# Altium schematic sheet Headers_Controller.SchDoc
size A3; SheetNumber: 1; SheetTotal: 1
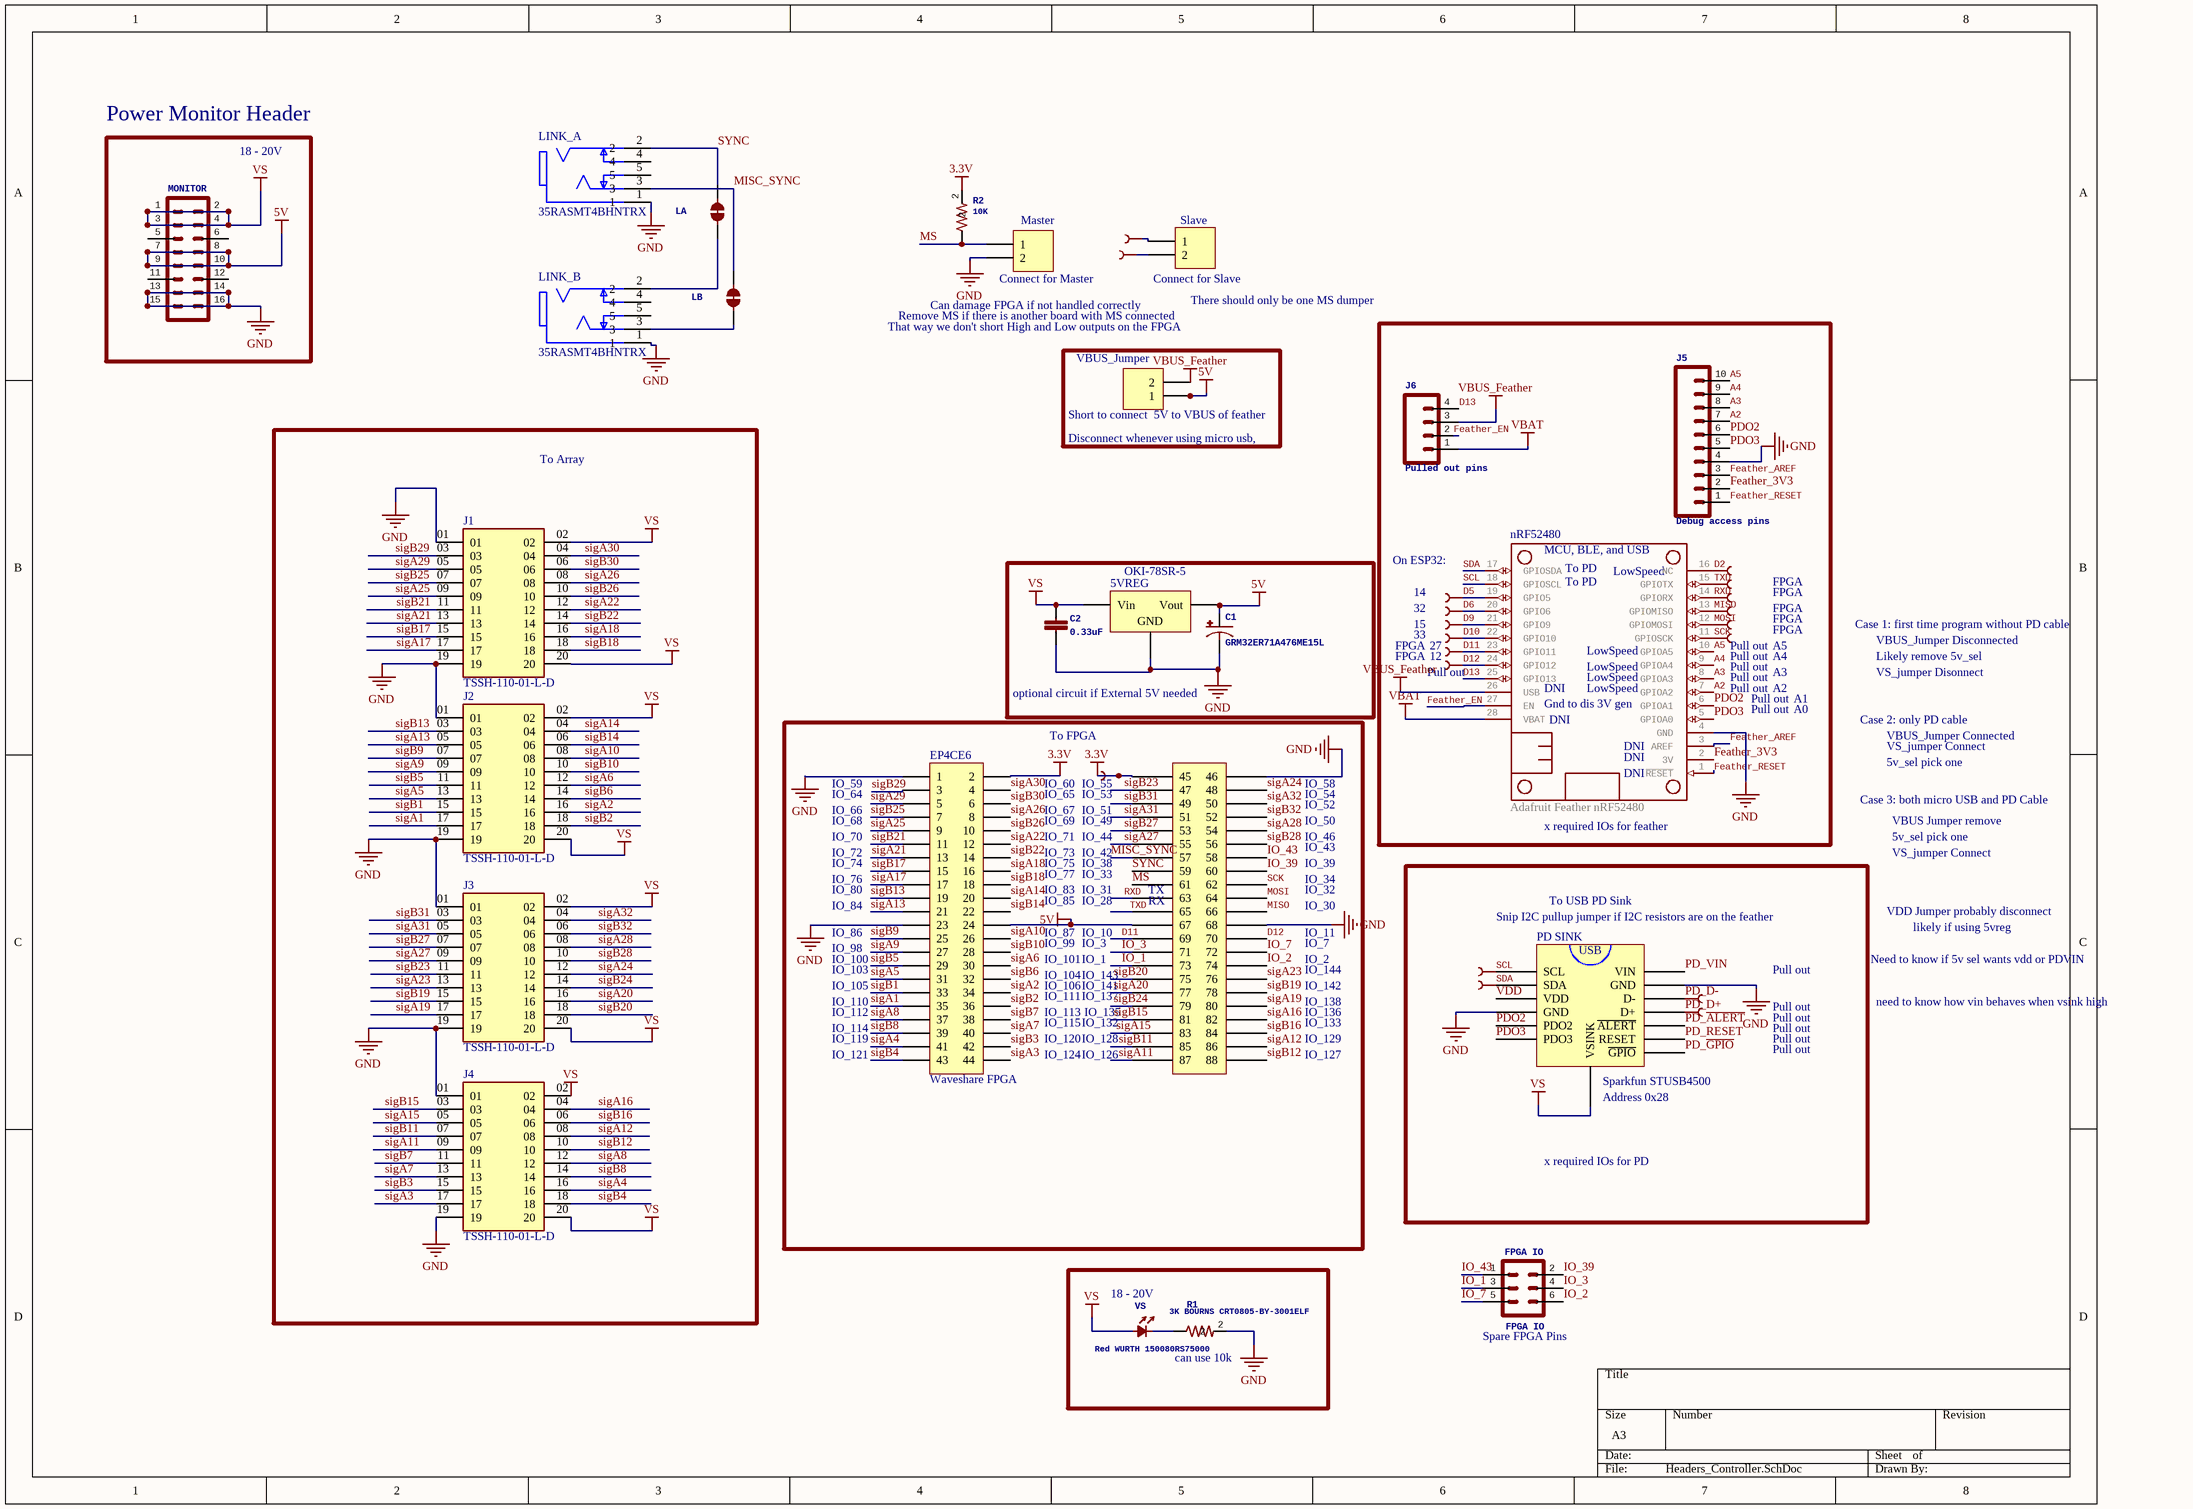
[diagram p0: Headers_Controller.SchDoc]

## Parts
3V3  TEST-POINT3X5  [PAD.03X.05]  (value not drawn)
5VREG  OKI-78SR-5  [OOKA-78SR]
C1  GRM32ER71A476ME15L  [EIA6032-NOM]
C2  0.33uF  [CAP0805]
D2  TEST-POINT3X5  [PAD.03X.05]  (value not drawn)
D5  TEST-POINT3X5  [PAD.03X.05]  (value not drawn)
D6  TEST-POINT3X5  [PAD.03X.05]  (value not drawn)
D9  TEST-POINT3X5  [PAD.03X.05]  (value not drawn)
D10  TEST-POINT3X5  [PAD.03X.05]  (value not drawn)
D11  TEST-POINT3X5  [PAD.03X.05]  (value not drawn)
D12  TEST-POINT3X5  [PAD.03X.05]  (value not drawn)
D+  TEST-POINT3X5  [PAD.03X.05]  (value not drawn)
D-  TEST-POINT3X5  [PAD.03X.05]  (value not drawn)
EP4CE6  Waveshare FPGA  [EP4CE6 Waveshare FPGA]
FPGA_IO  FPGA IO  [2X3]
J1  TSSH-110-01-L-D  [SAMTEC_TSSH-110-01-L-D]
J2  TSSH-110-01-L-D  [SAMTEC_TSSH-110-01-L-D]
J3  TSSH-110-01-L-D  [SAMTEC_TSSH-110-01-L-D]
J4  TSSH-110-01-L-D  [SAMTEC_TSSH-110-01-L-D]
J5  Debug access pins  [1X10 _ LOCK - header]
J6  Pulled out pins  [1X04_LOCK - header]
LA  Normally closed trace jumper    This jumper has a trace between two pads so it's normally closed (NC). Use a razor knife to open the connection. For best results follow the IPC guidelines for cutting traces: Cutout at least 0.063 mm (0.005 in).  Remove all loose material to clean up the cut area.  Seal the cut with an approved epoxy.       Reapply solder to reclose the connection.  [SMT-JUMPER_2_NC_TRACE_SILK]  (value not drawn)  (net tie, no BOM)
LB  Normally closed trace jumper    This jumper has a trace between two pads so it's normally closed (NC). Use a razor knife to open the connection. For best results follow the IPC guidelines for cutting traces: Cutout at least 0.063 mm (0.005 in).  Remove all loose material to clean up the cut area.  Seal the cut with an approved epoxy.       Reapply solder to reclose the connection.  [SMT-JUMPER_2_NC_TRACE_SILK]  (value not drawn)  (net tie, no BOM)
LINK_A  35RASMT4BHNTRX  [SWITCHCRAFT_35RASMT4BHNTRX]
LINK_B  35RASMT4BHNTRX  [SWITCHCRAFT_35RASMT4BHNTRX]
Master  Connect for Master  [1X02_LOCK_]
MISO  TEST-POINT3X5  [PAD.03X.05]  (value not drawn)
MONITOR  Access to power rails  [2X8]  (value not drawn)
MOSI  TEST-POINT3X5  [PAD.03X.05]  (value not drawn)
nRF52480  Adafruit Feather nRF52480  [Feather BLE nRF52480]
PD_SINK  Sparkfun STUSB4500  [Sparkfun STUSB4500]
R1  3K BOURNS CRT0805-BY-3001ELF  [RES-0805]
R2  10K  [RES-0805]
RX  TEST-POINT3X5  [PAD.03X.05]  (value not drawn)
SCK  TEST-POINT3X5  [PAD.03X.05]  (value not drawn)
SCL  TEST-POINT3X5  [PAD.03X.05]  (value not drawn)
SDA  TEST-POINT3X5  [PAD.03X.05]  (value not drawn)
Slave  Connect for Slave  [1X02_LOCK_]
TP1  TEST-POINT3X5  [PAD.03X.05]  (value not drawn)
TP2  TEST-POINT3X5  [PAD.03X.05]  (value not drawn)
TX  TEST-POINT3X5  [PAD.03X.05]  (value not drawn)
VBUS_Jumper  Short to connect  5V to VBUS of feather  [1X02_LOCK_]
VS  Red WURTH 150080RS75000  [LED-0805 - RED]

## Blocks framed on the sheet
Power Monitor Header: MONITOR
Disconnect whenever using micro usb,: VBUS_Jumper
To Array: J1-J4
optional circuit if External 5V needed: 5VREG C1 C2

## Nets
3.3V: 3V3.P$1 EP4CE6.2 EP4CE6.45 R2.2
5V: 5VREG.OUT(Vout) C1.A EP4CE6.24 EP4CE6.67 MONITOR.7 MONITOR.8 MONITOR.9 MONITOR.10 VBUS_Jumper.1
GND: 5VREG.GND C1.C C2.2 EP4CE6.1 EP4CE6.23 EP4CE6.46 EP4CE6.68 J1.01 J1.19 J2.01 J2.19 J3.01 J3.19 J4.01 J4.19 J5.4 LINK_A.1 LINK_B.1 Master.2 MONITOR.13 MONITOR.14 MONITOR.15 MONITOR.16 nRF52480.4(GND) PD_SINK.4(GND) PD_SINK.8(GND) R1.2
VBAT: J6.1 nRF52480.28(VBAT)
VBUS_Feather: J6.3 nRF52480.26(USB) VBUS_Jumper.2
VS: 5VREG.IN(Vin) C2.1 J1.02 J1.20 J2.02 J2.20 J3.02 J3.20 J4.02 J4.20 MONITOR.1 MONITOR.2 MONITOR.3 MONITOR.4 PD_SINK.14(VSINK) VS.+
A2: J5.7 nRF52480.7(GPIOA2)
A3: J5.8 nRF52480.8(GPIOA3)
A4: J5.9 nRF52480.9(GPIOA4)
A5: J5.10 nRF52480.10(GPIOA5)
D2: D2.P$1 nRF52480.16(NC)
D5: D5.P$1 nRF52480.19(GPIO5)
D6: D6.P$1 nRF52480.20(GPIO6)
D9: D9.P$1 nRF52480.21(GPIO9)
D10: D10.P$1 nRF52480.22(GPIO10)
D11: D11.P$1 EP4CE6.69 nRF52480.23(GPIO11)
D12: D12.P$1 EP4CE6.70 nRF52480.24(GPIO12)
D13: J6.4 nRF52480.25(GPIO13)
Feather_3V3: J5.2 nRF52480.2(3V)
Feather_AREF: J5.3 nRF52480.3(AREF)
Feather_EN: J6.2 nRF52480.27(EN)
Feather_RESET: J5.1 nRF52480.1(~{RESET})
IO_1: EP4CE6.73 FPGA_IO.3
IO_2: EP4CE6.74 FPGA_IO.6
IO_3: EP4CE6.71 FPGA_IO.4
IO_7: EP4CE6.72 FPGA_IO.5
IO_39: EP4CE6.60 FPGA_IO.2
IO_43: EP4CE6.58 FPGA_IO.1
MISC_SYNC: EP4CE6.57 LB.2 LINK_A.3
MISO: EP4CE6.66 MISO.P$1 nRF52480.13(GPIOMISO)
MOSI: EP4CE6.64 MOSI.P$1 nRF52480.12(GPIOMOSI)
MS: EP4CE6.61 Master.1 R2.1
PD_~{ALERT}: PD_SINK.11(~{ALERT})
PD_D+: D+.P$1 PD_SINK.10(D+)
PD_D-: D-.P$1 PD_SINK.9(D-)
PD_~{GPIO}: PD_SINK.13(~{GPIO})
PD_RESET: PD_SINK.12(RESET)
PD_VIN: PD_SINK.7(VIN)
PDO2: J5.6 nRF52480.6(GPIOA1) PD_SINK.5(PDO2)
PDO3: J5.5 nRF52480.5(GPIOA0) PD_SINK.6(PDO3)
RXD: EP4CE6.63 nRF52480.14(GPIORX) RX.P$1
SCK: EP4CE6.62 nRF52480.11(GPIOSCK) SCK.P$1
SCL: nRF52480.18(GPIOSCL) PD_SINK.1(SCL) SCL.P$1
SDA: nRF52480.17(GPIOSDA) PD_SINK.2(SDA) SDA.P$1
sigA1: EP4CE6.35 J2.17
sigA2: EP4CE6.34 J2.16
sigA3: EP4CE6.44 J4.17
sigA4: EP4CE6.41 J4.16
sigA5: EP4CE6.31 J2.13
sigA6: EP4CE6.30 J2.12
sigA7: EP4CE6.40 J4.13
sigA8: EP4CE6.37 J4.12
sigA9: EP4CE6.27 J2.09
sigA10: EP4CE6.26 J2.08
sigA11: EP4CE6.87 J4.09
sigA12: EP4CE6.86 J4.08
sigA13: EP4CE6.21 J2.05
sigA14: EP4CE6.20 J2.04
sigA15: EP4CE6.83 J4.05
sigA16: EP4CE6.82 J4.04
sigA17: EP4CE6.17 J1.17
sigA18: EP4CE6.16 J1.16
sigA19: EP4CE6.80 J3.17
sigA20: EP4CE6.77 J3.16
sigA21: EP4CE6.13 J1.13
sigA22: EP4CE6.12 J1.12
sigA23: EP4CE6.76 J3.13
sigA24: EP4CE6.48 J3.12
sigA25: EP4CE6.9 J1.09
sigA26: EP4CE6.8 J1.08
sigA27: EP4CE6.55 J3.09
sigA28: EP4CE6.54 J3.08
sigA29: EP4CE6.5 J1.05
sigA30: EP4CE6.4 J1.04
sigA31: EP4CE6.51 J3.05
sigA32: EP4CE6.50 J3.04
sigB1: EP4CE6.33 J2.15
sigB2: EP4CE6.36 J2.18
sigB3: EP4CE6.42 J4.15
sigB4: EP4CE6.43 J4.18
sigB5: EP4CE6.29 J2.11
sigB6: EP4CE6.32 J2.14
sigB7: EP4CE6.38 J4.11
sigB8: EP4CE6.39 J4.14
sigB9: EP4CE6.25 J2.07
sigB10: EP4CE6.28 J2.10
sigB11: EP4CE6.85 J4.07
sigB12: EP4CE6.88 J4.10
sigB13: EP4CE6.19 J2.03
sigB14: EP4CE6.22 J2.06
sigB15: EP4CE6.81 J4.03
sigB16: EP4CE6.84 J4.06
sigB17: EP4CE6.15 J1.15
sigB18: EP4CE6.18 J1.18
sigB19: EP4CE6.78 J3.15
sigB20: EP4CE6.75 J3.18
sigB21: EP4CE6.11 J1.11
sigB22: EP4CE6.14 J1.14
sigB23: EP4CE6.47 J3.11
sigB24: EP4CE6.79 J3.14
sigB25: EP4CE6.7 J1.07
sigB26: EP4CE6.10 J1.10
sigB27: EP4CE6.53 J3.07
sigB28: EP4CE6.56 J3.10
sigB29: EP4CE6.3 J1.03
sigB30: EP4CE6.6 J1.06
sigB31: EP4CE6.49 J3.03
sigB32: EP4CE6.52 J3.06
SYNC: EP4CE6.59 LA.2 LINK_A.2
TXD: EP4CE6.65 nRF52480.15(GPIOTX) TX.P$1
VDD: PD_SINK.3(VDD)
NetLA_1: LA.1 LINK_B.2
NetLB_1: LB.1 LINK_B.3
NetR1_1: R1.1 VS.-
NetSlave_1: Slave.1 TP1.P$1
NetSlave_2: Slave.2 TP2.P$1

Not connected (* = marked no-connect by the designer): LINK_A 4 5; LINK_B 4 5; MONITOR 5 6 11 12

## Notes on the sheet
- 18 - 20V
- Can damage FPGA if not handled correctly
- There should only be one MS dumper
- That way we don't short High and Low outputs on the FPGA
- Remove MS if there is another board with MS connected
- On ESP32:
- (near nRF52480) MCU, BLE, and USB
- (near nRF52480) To PD
- (near nRF52480) LowSpeed
- FPGA
- 14
- 32
- 15
- 33
- 27
- Pull out
- A5
- Case 1: first time program without PD cable
- VBUS_Jumper Disconnected
- (near D12) Pull out
- 12
- (near nRF52480) Gnd to dis 3V gen
- (near nRF52480) DNI
- A2
- A3
- A4
- A0
- A1
- Likely remove 5v_sel
- VS_jumper Disonnect
- IO_59
- (near EP4CE6) IO_60
- To FPGA
- (near EP4CE6) IO_55
- IO_58
- Case 2: only PD cable
- VBUS_Jumper Connected
- VS_jumper Connect
- 5v_sel pick one
- IO_64
- IO_66
- IO_68
- IO_70
- IO_72
- (near EP4CE6) IO_65
- (near EP4CE6) IO_67
- (near EP4CE6) IO_69
- (near EP4CE6) IO_71
- (near EP4CE6) IO_73
- (near EP4CE6) IO_42
- (near EP4CE6) IO_44
- (near EP4CE6) IO_49
- (near EP4CE6) IO_51
- (near EP4CE6) IO_53
- IO_43
- IO_46
- IO_50
- IO_52
- IO_54
- (near nRF52480) x required IOs for feather
- Case 3: both micro USB and PD Cable
- VBUS Jumper remove
- IO_74
- IO_76
- IO_80
- IO_84
- (near EP4CE6) IO_75
- (near EP4CE6) IO_77
- (near EP4CE6) IO_83
- (near EP4CE6) IO_85
- (near EP4CE6) IO_31
- (near EP4CE6) IO_33
- (near EP4CE6) IO_38
- (near EP4CE6) IO_28
- (near EP4CE6) TX
- (near EP4CE6) RX
- IO_30
- IO_32
- IO_34
- IO_39
- Snip I2C pullup jumper if I2C resistors are on the feather
- To USB PD Sink
- VDD Jumper probably disconnect
- IO_86
- IO_98
- IO_100
- IO_103
- IO_105
- (near EP4CE6) IO_87
- (near EP4CE6) IO_99
- (near EP4CE6) IO_101
- (near EP4CE6) IO_104
- (near EP4CE6) IO_106
- (near EP4CE6) IO_1
- (near EP4CE6) IO_3
- (near EP4CE6) IO_10
- (near EP4CE6) IO_141
- (near EP4CE6) IO_143
- IO_2
- IO_7
- IO_11
- IO_142
- IO_144
- Need to know if 5v sel wants vdd or PDVIN
- likely if using 5vreg
- IO_110
- IO_112
- IO_114
- IO_119
- IO_121
- (near EP4CE6) IO_111
- (near EP4CE6) IO_113
- (near EP4CE6) IO_115
- (near EP4CE6) IO_120
- (near EP4CE6) IO_124
- (near EP4CE6) IO_126
- (near EP4CE6) IO_128
- (near EP4CE6) IO_132
- (near EP4CE6) IO_137
- (near EP4CE6) IO_135
- IO_127
- IO_129
- IO_133
- IO_136
- IO_138
- need to know how vin behaves when vsink high
- (near PD_SINK) Address 0x28
- x required IOs for PD
- (near VS) 18 - 20V
- can use 10k
- (near FPGA_IO) Spare FPGA Pins
- (in symbol Sparkfun STUSB) USB

## Library data of the parts
5VREG = Volt Reg: Voltage Regulator; Published: 24-Mar-1999; LatestRevisionDate: 29-May-2009; LatestRevisionNote: IPC-7351 Footprint Added.; PackageReference: D2PAK; Publisher: Altium Limited; PackageDescription: 3-Pin Transistor Outline Package 2.54 mm Pitch, 15.1 mm Lead Span; Datasheet: http://www.farnell.com/datasheets/1904473.pdf?_ga=2.85272922.296638663.1549285494-96194751.1546862067
C1 = CAP ELECTRO: PROD_ID: CAP-09538
C2 = CAP CERAMIC: PROD_ID: CAP-08280
EP4CE6 = EP4CE6: MF: {'manufacturer': u'TE Connectivity'}; MP: 7-534206-2; Value: *; Package: None; Availability: Unavailable; Price: None
FPGA_IO = CONN_03X22X3_SILK_MALE_PTH: PROD_ID: CONN-09701
J1-J4 = TSSH-110-01-L-D: System: Connector; Package: None; Price: None; Value: *; MP: TSSH-110-01-L-D
J5 = CONN_10LOCK_1
J6 = CONN_04LOCK: Debug access pins; PROD_ID: CONN-09696
LA LB = JUMPER-SMT_2_NC_TRACE_SILK: Optional disconnect
LINK_A = 35RASMT4BHNTRX: Sync port A; MF: {'manufacturer': u'Switchcraft'}; Price: None; Package: None; Availability: Unavailable; Value: *; MP: 35RASMT4BHNTRX
LINK_B = 35RASMT4BHNTRX: Sync port B; MF: {'manufacturer': u'Switchcraft'}; Price: None; Package: None; Availability: Unavailable; Value: *; MP: 35RASMT4BHNTRX
Master = Header 2: LatestRevisionDate: 17-Jul-2002; LatestRevisionNote: Re-released for DXP Platform.; Publisher: Altium Limited
MONITOR = CONN_08X2_HEADER
nRF52480 = FEATHERWING_NODIM: GateName_1: G$1; SymbolName_1: MICROSHIELD; DeviceName: _NODIM; LibraryName: microbuilder; DeviceSetName: FEATHERWING
PD_SINK = Sparkfun STUSB: Replace with purple board
R1 R2 = RESISTOR: MPN: CRCW0603470RFKEA; MF: Vishay; OC_MOUSER: 71-CRCW0603-470-E3; PACKAGE: 0603; TYPE: Resistor
Slave VBUS_Jumper = Header 2: Header, 2-Pin; LatestRevisionDate: 17-Jul-2002; LatestRevisionNote: Re-released for DXP Platform.; Publisher: Altium Limited
VS = LED: PACKAGE: 0805; Datasheet: https://docs-emea.rs-online.com/webdocs/1302/0900766b81302e21.pdf